# Altium schematic sheet 原理图Ver03_2023-04-25.schdoc
size 627 x 312 mm
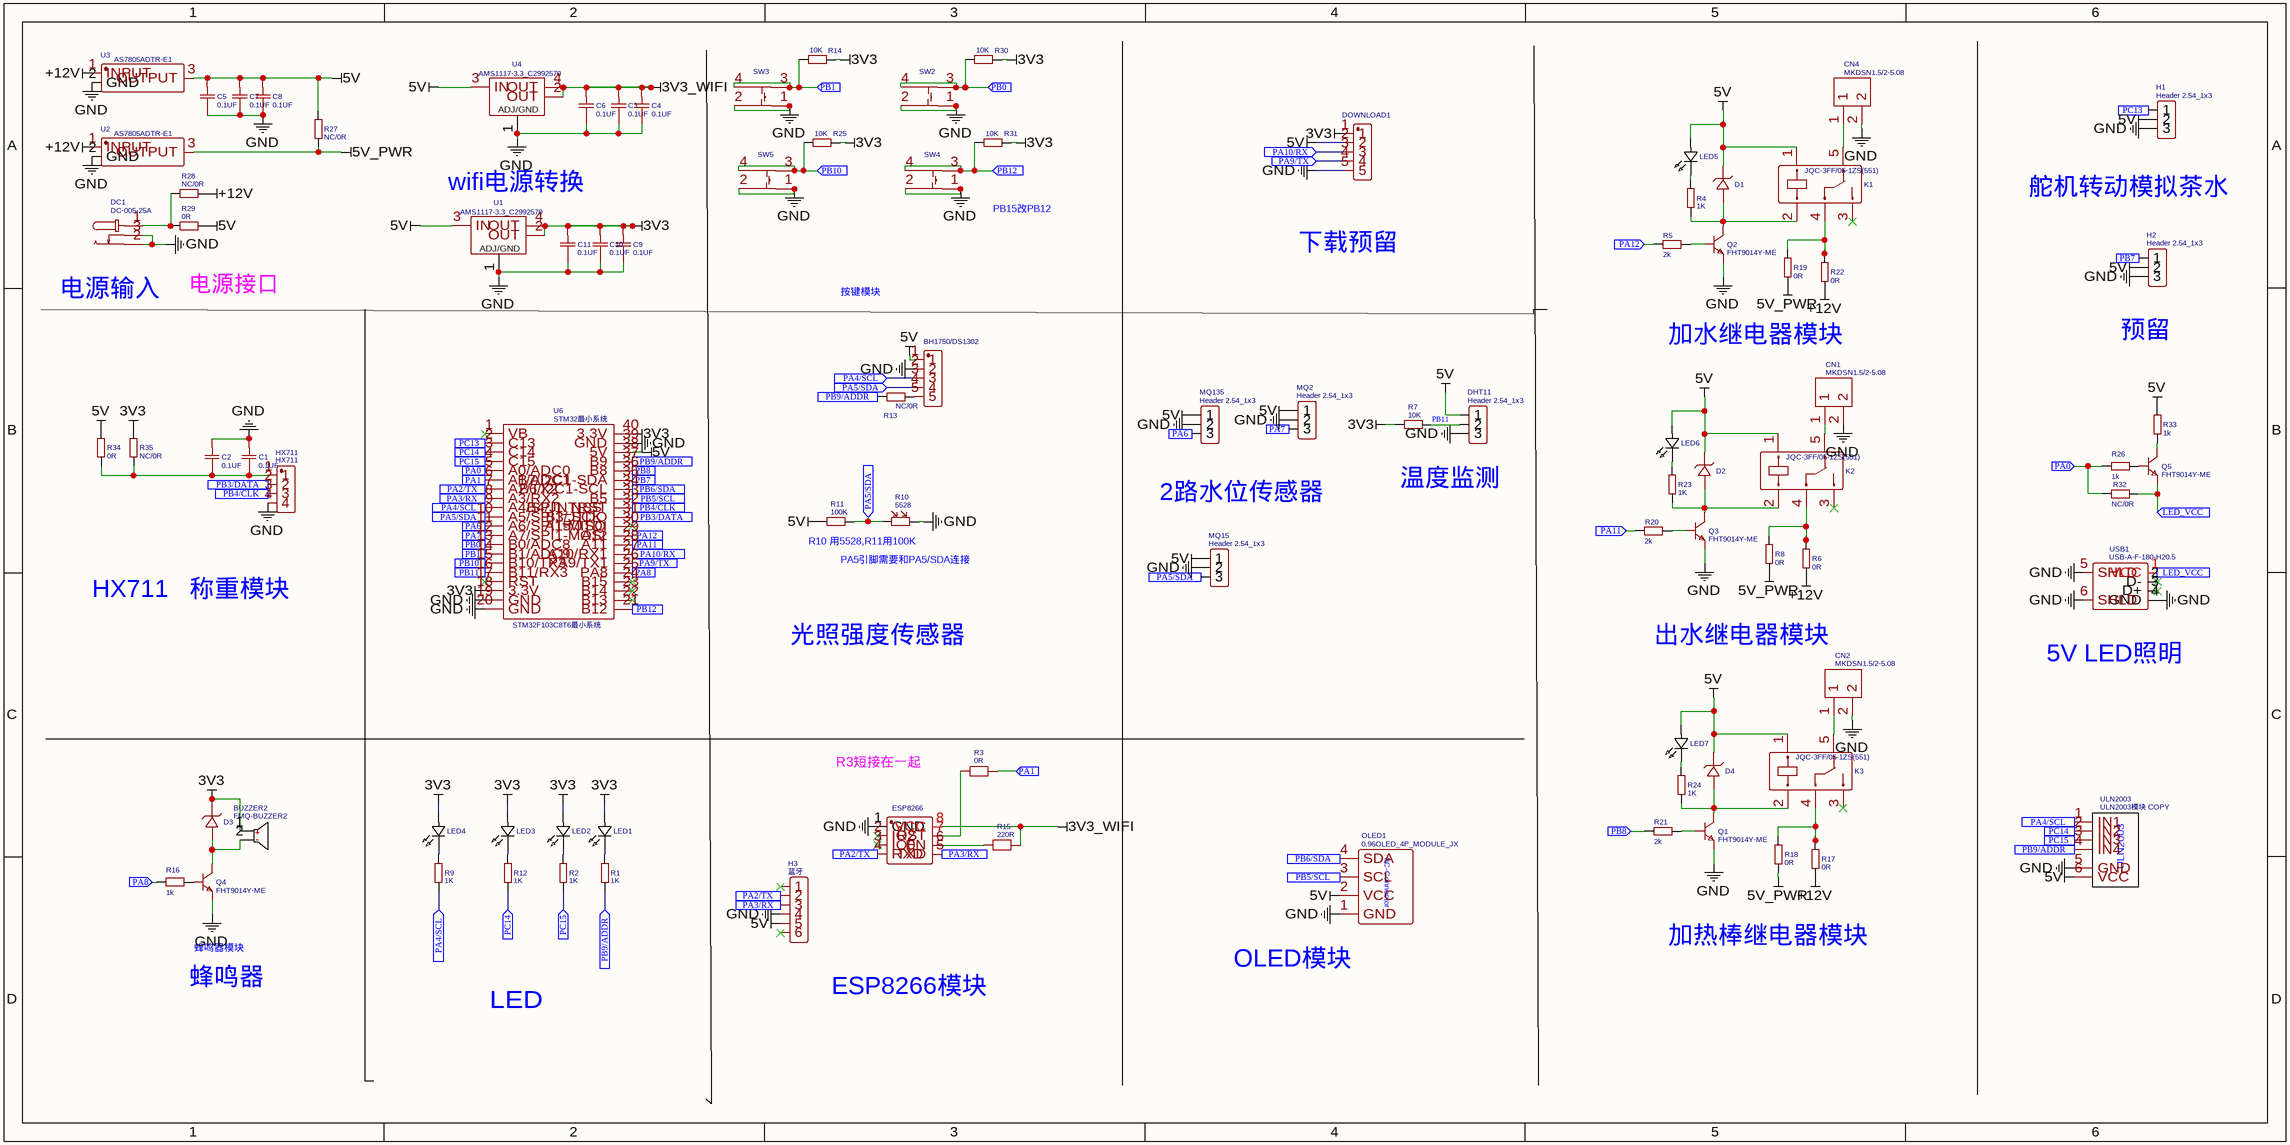
[diagram p0: 原理图Ver03_2023-04-25.schdoc]

## Parts
BH1750/DS1302  Female header　2.54 1*5Ｐ  [HDR-TH_5P-P2.54-V-F]  (value not drawn)
BUZZER2  FMQ-BUZZER2  [BUZ-TH_BD12.0-P7.60-D0.6-FD]
C1  0.1UF  [C0603]
C2  0.1UF  [C0603]
C3  0.1UF  [C0603]
C4  0.1UF  [C0603]
C5  0.1UF  [C0603]
C6  0.1UF  [C0603]
C7  0.1UF  [C0603]
C8  0.1UF  [C0603]
C9  0.1UF  [C0603]
C10  0.1UF  [C0603]
C11  0.1UF  [C0603]
CN1  MKDSN1.5/2-5.08  [CONN-TH_2P-P5.08_1714984]
CN2  MKDSN1.5/2-5.08  [CONN-TH_2P-P5.08_1714984]
CN4  MKDSN1.5/2-5.08  [CONN-TH_2P-P5.08_1714984]
D1  1N4734A_C238924  [LL-41_L5.0-W2.5-RD]  (value not drawn)
D2  1N4734A_C238924  [LL-41_L5.0-W2.5-RD]  (value not drawn)
D3  1N4734A_C238924  [LL-41_L5.0-W2.5-RD]  (value not drawn)
D4  1N4734A_C238924  [LL-41_L5.0-W2.5-RD]  (value not drawn)
DC1  DC-005-25A  [DC-IN-TH_DC005]
DHT11  Header 2.54_1x3  [HDR-TH_3P-P2.54-V-M-1]
DOWNLOAD1  Female header　2.54 1*5Ｐ  [HDR-TH_5P-P2.54-V-F]  (value not drawn)
ESP8266  ESP-01S_C503582  [WIFIM-TH_8P-L24.7-W14.4-P2.54]  (value not drawn)
H1  Header 2.54_1x3  [HDR-TH_3P-P2.54-V-M-1]
H2  Header 2.54_1x3  [HDR-TH_3P-P2.54-V-M-1]
H3  蓝牙  [HDR-TH_6P-P2.54-V-M-1]
HX711  HX711  [HDR-TH_4P-P2.54-V-F]
K1  JQC-3FF/05-1ZS(551)  [RELAY-TH_HF3FF-XX-1ZXX-XXX]
K2  JQC-3FF/05-1ZS(551)  [RELAY-TH_HF3FF-XX-1ZXX-XXX]
K3  JQC-3FF/05-1ZS(551)  [RELAY-TH_HF3FF-XX-1ZXX-XXX]
LED1  264-7SURT/S530-A3  [LED-TH_BD3.2-P2.54-RD]  (value not drawn)
LED2  264-7SURT/S530-A3  [LED-TH_BD3.2-P2.54-RD]  (value not drawn)
LED3  264-7SURT/S530-A3  [LED-TH_BD3.2-P2.54-RD]  (value not drawn)
LED4  264-7SURT/S530-A3  [LED-TH_BD3.2-P2.54-RD]  (value not drawn)
LED5  264-7SURT/S530-A3  [LED-TH_BD3.2-P2.54-RD]  (value not drawn)
LED6  264-7SURT/S530-A3  [LED-TH_BD3.2-P2.54-RD]  (value not drawn)
LED7  264-7SURT/S530-A3  [LED-TH_BD3.2-P2.54-RD]  (value not drawn)
MQ2  Header 2.54_1x3  [HDR-TH_3P-P2.54-V-M-1]
MQ15  Header 2.54_1x3  [HDR-TH_3P-P2.54-V-M-1]
MQ135  Header 2.54_1x3  [HDR-TH_3P-P2.54-V-M-1]
OLED1  0.96OLED_4P_MODULE_JX  [0.96OLED_4P]
Q1  FHT9014Y-ME  [SOT-23-3_L2.9-W1.3-P1.90-LS2.4-BR]
Q2  FHT9014Y-ME  [SOT-23-3_L2.9-W1.3-P1.90-LS2.4-BR]
Q3  FHT9014Y-ME  [SOT-23-3_L2.9-W1.3-P1.90-LS2.4-BR]
Q4  FHT9014Y-ME  [SOT-23-3_L2.9-W1.3-P1.90-LS2.4-BR]
Q5  FHT9014Y-ME  [SOT-23-3_L2.9-W1.3-P1.90-LS2.4-BR]
R1  1K  [0805]
R2  1K  [0805]
R3  0R  [R0603]
R4  1K  [0805]
R5  2k  [0805]
R6  0R  [0805]
R7  10K  [0805]
R8  0R  [0805]
R9  1K  [0805]
R10  5528  [RES-TH_L5.1-W4.3-P3.40-D0.5]
R11  100K  [0805]
R12  1K  [0805]
R13  NC/0R  [0805]
R14  10K  [0805]
R15  220R  [R0603]
R16  1k  [0805]
R17  0R  [0805]
R18  0R  [0805]
R19  0R  [0805]
R20  2k  [0805]
R21  2k  [0805]
R22  0R  [0805]
R23  1K  [0805]
R24  1K  [0805]
R25  10K  [0805]
R26  1k  [0805]
R27  NC/0R  [0805]
R28  NC/0R  [0805]
R29  0R  [0805]
R30  10K  [0805]
R31  10K  [0805]
R32  NC/0R  [0805]
R33  1k  [0805]
R34  0R  [0805]
R35  NC/0R  [0805]
SW2  K2-1102DP-A4SW-04  [SW-SMD_4P-L6.0-W6.0-P4.50-LS10.0-BL-SOKA]  (value not drawn)
SW3  K2-1102DP-A4SW-04  [SW-SMD_4P-L6.0-W6.0-P4.50-LS10.0-BL-SOKA]  (value not drawn)
SW4  K2-1102DP-A4SW-04  [SW-SMD_4P-L6.0-W6.0-P4.50-LS10.0-BL-SOKA]  (value not drawn)
SW5  K2-1102DP-A4SW-04  [SW-SMD_4P-L6.0-W6.0-P4.50-LS10.0-BL-SOKA]  (value not drawn)
U1  AMS1117-3.3_C2992570  [SOT-223-3_L6.4-W3.5-P2.30-LS7.0-BR]
U2  AS7805ADTR-E1  [TO-252-2_L6.6-W6.1-P4.57-LS9.9-BR-CW]
U3  AS7805ADTR-E1  [TO-252-2_L6.6-W6.1-P4.57-LS9.9-BR-CW]
U4  AMS1117-3.3_C2992570  [SOT-223-3_L6.4-W3.5-P2.30-LS7.0-BR]
U6  STM32最小系统  [STM32最小系统板C8T6]
ULN2003  ULN2003模块 COPY  [ULN2003-SOKA]
USB1  USB-A-F-180-H20.5  [USB-A-TH_C168710]

## Ports
LED_VCC (in), PA0 (in), PA1 (in), PA2/TX (in), PA3/RX (in), PA4/SCL (in), PA5/SDA (in), PA6 (in), PA7 (in), PA8 (in), PA9/TX (in), PA10/RX (in), PA11 (in), PA12 (in), PB0 (in), PB1 (in), PB3/DATA (in), PB4/CLK (in), PB5/SCL (in), PB6/SDA (in), PB7 (in), PB8 (in), PB9/ADDR (in), PB10 (in), PB11 (in), PB12 (in), PC13 (in), PC14 (in), PC15 (in)

## Nets
3V3: BUZZER2.1 C9.2 C10.2 C11.2 D3.1(K) DOWNLOAD1.1 LED1.2(+) LED2.2(+) LED3.2(+) LED4.2(+) R7.2 R14.1 R25.1 R30.1 R31.1 R35.2 U1.2(OUT) U1.4(OUT) U6.18(3.3V) U6.40(3.3V)
3V3_WIFI: C3.2 C4.2 C6.2 ESP8266.8(VCC) R15.1 U4.2(OUT) U4.4(OUT)
5V: BH1750/DS1302.1 C5.2 C7.2 C8.2 D1.1(K) D2.1(K) D4.1(K) DHT11.1 DOWNLOAD1.2 H1.2 H2.2 H3.5 K1.1 K2.1 K3.1 LED5.2(+) LED6.2(+) LED7.2(+) MQ2.1 MQ15.1 MQ135.1 OLED1.2(VCC) R11.2 R27.2 R29.2 R33.2 R34.2 U1.3(IN) U3.3(OUTPUT) U4.3(IN) U6.38(5V) ULN2003.6(VCC)
5V_PWR: R8.1 R18.1 R19.1 R27.1 U2.3(OUTPUT)
+12V: R6.1 R17.1 R22.1 R28.2 U2.1(INPUT) U3.1(INPUT)
GND: BH1750/DS1302.2 C1.2 C2.2 C3.1 C4.1 C5.1 C6.1 C7.1 C8.1 C9.1 C10.1 C11.1 CN1.2 CN2.2 CN4.2 DC1.2 DC1.3 DHT11.3 DOWNLOAD1.5 ESP8266.1(GND) H1.3 H2.3 H3.4 HX711.4 MQ2.2 MQ15.2 MQ135.2 OLED1.1(GND) Q1.2(E) Q2.2(E) Q3.2(E) Q4.2(E) R10.2 SW2.1 SW2.2 SW3.1 SW3.2 SW4.1 SW4.2 SW5.1 SW5.2 U1.1(ADJ/GND) U2.2(GND) U3.2(GND) U4.1(ADJ/GND) U6.19(GND) U6.20(GND) U6.39(GND) ULN2003.5(GND) USB1.4(GND) USB1.5(SHLD) USB1.6(SHLD)
LED_VCC: Q5.2(E) R32.2 USB1.1(VCC) ; port LED_VCC
PA0: R26.1 R32.1 U6.5(A0/ADC0) ; port PA0
PA1: R3.1 U6.6(A1/ADC1) ; port PA1
PA2/TX: ESP8266.4(RXD) H3.2 U6.7(A2/TX2) ; port PA2/TX
PA3/RX: ESP8266.5(TXD) H3.3 U6.8(A3/RX2) ; port PA3/RX
PA4/SCL: BH1750/DS1302.3 R9.1 U6.9(A4/SPI1_NSS) ULN2003.1(IN1) ; port PA4/SCL
PA5/SDA: BH1750/DS1302.4 MQ15.3 R10.1 R11.1 U6.10(A5/SPI1_SCK) ; port PA5/SDA
PA6: MQ135.3 U6.11(A6/SPI1-MISO) ; port PA6
PA7: MQ2.3 U6.12(A7/SPI1-MOSI) ; port PA7
PA8: R16.1 U6.25(PA8) ; port PA8
PA9/TX: DOWNLOAD1.4 U6.26(PA9/TX1) ; port PA9/TX
PA10/RX: DOWNLOAD1.3 U6.27(A10/RX1) ; port PA10/RX
PA11: R20.1 U6.28(A11) ; port PA11
PA12: R5.1 U6.29(A12) ; port PA12
PB0: R30.2 SW2.3 SW2.4 U6.13(B0/ADC8) ; port PB0
PB1: R14.2 SW3.3 SW3.4 U6.14(B1/ADC9) ; port PB1
PB3/DATA: HX711.2 U6.31(B3/JTDO) ; port PB3/DATA
PB4/CLK: HX711.3 U6.32(B4/JNTRST) ; port PB4/CLK
PB5/SCL: OLED1.3(SCL) U6.33(B5) ; port PB5/SCL
PB6/SDA: OLED1.4(SDA) U6.34(B6/I2C1-SCL) ; port PB6/SDA
PB7: H2.1 U6.35(B7/I2C1-SDA) ; port PB7
PB8: R21.1 U6.36(B8) ; port PB8
PB9/ADDR: R1.1 R13.2 U6.37(B9) ULN2003.4(IN4) ; port PB9/ADDR
PB10: R25.2 SW5.3 SW5.4 U6.15(B10/TX3) ; port PB10
PB11: U6.16(B11/RX3) ; port PB11
PB11: DHT11.2 R7.1  [a separate net that carries the same name]
PB12: R31.2 SW4.3 SW4.4 U6.21(B12) ; port PB12
PC13: H1.1 U6.2(C13) ; port PC13
PC14: R12.1 U6.3(C14) ULN2003.2(IN2) ; port PC14
PC15: R2.1 U6.4(C15) ULN2003.3(IN3) ; port PC15
NetBH1750/DS1302_5: BH1750/DS1302.5 R13.1
NetBUZZER2_2: BUZZER2.2 D3.2(A) Q4.3(C)
NetC1_1: C1.1 C2.1 HX711.1 R34.1 R35.1
NetCN1_1: CN1.1 K2.5
NetCN2_1: CN2.1 K3.5
NetCN4_1: CN4.1 K1.5
NetD1_2: D1.2(A) K1.2 Q2.3(C) R4.1
NetD2_2: D2.2(A) K2.2 Q3.3(C) R23.1
NetD4_2: D4.2(A) K3.2 Q1.3(C) R24.1
NetDC1_1: DC1.1 R28.1 R29.1
NetESP8266_6: ESP8266.6(EN) R15.2
NetESP8266_7: ESP8266.7(RST) R3.2
NetK1_4: K1.4 R19.2 R22.2
NetK2_4: K2.4 R6.2 R8.2
NetK3_4: K3.4 R17.2 R18.2
NetLED1_1: LED1.1(-) R1.2
NetLED2_1: LED2.1(-) R2.2
NetLED3_1: LED3.1(-) R12.2
NetLED4_1: LED4.1(-) R9.2
NetLED5_1: LED5.1(-) R4.2
NetLED6_1: LED6.1(-) R23.2
NetLED7_1: LED7.1(-) R24.2
NetQ1_1: Q1.1(B) R21.2
NetQ2_1: Q2.1(B) R5.2
NetQ3_1: Q3.1(B) R20.2
NetQ4_1: Q4.1(B) R16.2
NetQ5_1: Q5.1(B) R26.2
NetQ5_3: Q5.3(C) R33.1

Not connected (* = marked no-connect by the designer): ESP8266 2(IO2)* 3(IO0)*; H3 1* 6*; K1 3*; K2 3*; K3 3*; U6 1(VB)* 17(RST)* 22(B13)* 23(B14)* 24(B15)* 30(A15/JTDI)*; USB1 2(D-)* 3(D+)*

## Notes on the sheet
- wifi电源转换
- PB15改PB12
- 舵机转动模拟茶水
- 下载预留
- (near DC1) 电源输入
- 电源接口
- 按键模块
- 加水继电器模块
- 预留
- 2路水位传感器
- 温度监测
- R10 用5528,R11用100K
- HX711   称重模块
- PA5引脚需要和PA5/SDA连接
- 光照强度传感器
- 出水继电器模块
- 5V LED照明
- R3短接在一起
- 蜂鸣器模块
- OLED模块
- 加热棒继电器模块
- 蜂鸣器
- LED
- ESP8266模块
- (in symbol 0.96OLED_4P_MODULE_JX) IIC-Connector
- (in symbol STM32最小系统) STM32F103C8T6最小系统

## Library data of the parts
BH1750/DS1302 DOWNLOAD1 = Female header　2.54 1*5Ｐ: BOM_Manufacturer: ReliaPro; BOM_Supplier Part: C46341; BOM_Supplier: LCSC; BOM_Manufacturer Part: Female header　2.54 1*5Ｐ; spicePre: H; spiceSymbolName: Female header　2.54 1*5Ｐ
BUZZER2 = FMQ-BUZZER2: Contributor: LCSC; BOM_Supplier: LCSC; BOM_Supplier Part: C9900006103; BOM_Manufacturer Part: FMQ-BUZZER2; BOM_JLCPCB Part Class: Extended Part; spicePre: B; spiceSymbolName: FMQ-BUZZER2
C1-C11 = 0.1UF: nameAlias: Value(F); Contributor: LCEDA_Lib; spicePre: C; spiceSymbolName: C_0603_US
CN1 CN2 CN4 = MKDSN1.5/2-5.08: BOM_Manufacturer: Phoenix Contact; BOM_Supplier: LCSC; BOM_Manufacturer Part: MKDSN1.5/2-5.08; BOM_Supplier Part: C91153; BOM_JLCPCB Part Class: Extended Part; spicePre: C; spiceSymbolName: MKDSN1.5/2-5.08
D1-D4 = 1N4734A_C238924: BOM_Manufacturer: ON Semicon; Contributor: LCSC; BOM_Supplier: LCSC; BOM_Supplier Part: C238924; BOM_Manufacturer Part: 1N4734A; BOM_JLCPCB Part Class: Extended Part; spicePre: D; spiceSymbolName: 1N4734A_C238924
DC1 = DC-005-25A: BOM_Manufacturer: HRO; Contributor: LCSC; BOM_Supplier: LCSC; BOM_Manufacturer Part: DC-005-25A; BOM_Supplier Part: C136715; spicePre: D; spiceSymbolName: DC-005-25A
DHT11 H1 H2 MQ2 MQ15 MQ135 = Header 2.54_1x3: BOM_Manufacturer: BOOMELE; BOM_Manufacturer Part: Header2.54mm 1*3P; BOM_Supplier: LCSC; BOM_Supplier Part: C49257; BOM_JLCPCB Part Class: Extended Part; spicePre: H; spiceSymbolName: Header-Male-2.54_1x3
ESP8266 = ESP-01S_C503582: BOM_Manufacturer: Ai-Thinker; Contributor: LCSC; BOM_Supplier: LCSC; BOM_Supplier Part: C503582; BOM_Manufacturer Part: ESP-01S; spicePre: U; spiceSymbolName: ESP-01S_C503582
H3 = 蓝牙: BOM_Manufacturer: BOOMELE; BOM_Manufacturer Part: Header-Male-2.54_1x6; BOM_Supplier: LCSC; BOM_Supplier Part: C37208; BOM_JLCPCB Part Class: Extended Part; spicePre: H; spiceSymbolName: Header-Male-2.54_1x6
HX711 = HX711: BOM_Manufacturer: BOOMELE; BOM_Manufacturer Part: Female header1*4P; Contributor: Sally; BOM_Supplier: LCSC; BOM_Supplier Part: C66508; spicePre: P; spiceSymbolName: Female header1*4P
K1-K3 = JQC-3FF/05-1ZS(551): BOM_Manufacturer: HF; BOM_Supplier: LCSC; BOM_Manufacturer Part: JQC-3FF/05-1ZS(551); BOM_Supplier Part: C9221; BOM_JLCPCB Part Class: Extended Part; spicePre: K; spiceSymbolName: JQC-3FF/05-1ZS(551)
LED1-LED7 = 264-7SURT/S530-A3: BOM_Manufacturer: Everlight Elec; Contributor: LCSC; Package Display: No; BOM_Supplier: LCSC; BOM_Supplier Part: C710207; BOM_Manufacturer Part: 264-7SURT/S530-A3; spicePre: L; spiceSymbolName: 264-7SURT/S530-A3
OLED1 = 0.96OLED_4P_MODULE_JX: BOM_Manufacturer: null; Contributor: LCSC; BOM_Supplier: LCSC; BOM_Supplier Part: C9900004566; BOM_Manufacturer Part: 0.96OLED_4P_MODULE_JX; BOM_JLCPCB Part Class: Extended Part; spicePre: O; spiceSymbolName: 0.96OLED_4P_MODULE_JX
Q1-Q5 = FHT9014Y-ME: BOM_Manufacturer: FH; BOM_Supplier: LCSC; BOM_Manufacturer Part: FHT9014Y-ME; BOM_Supplier Part: C88861; BOM_JLCPCB Part Class: Extended Part; spicePre: Q; spiceSymbolName: FHT9014Y-ME
R1 R2 R4 R9 R12 R23 R24 = 1K: BOM_Manufacturer: Tyohm; BOM_Manufacturer Part: RMC08051K5%N; nameAlias: Resistance (Ohms); Contributor: LCSC; BOM_Supplier: LCSC; BOM_Supplier Part: C269727; spicePre: R; spiceSymbolName: RMC08051K5%N
R3 = 0R: nameAlias: Value(Ω); Contributor: LCEDA_Lib; spicePre: R; spiceSymbolName: R_0603_EU
R5 R20 R21 = 2k: BOM_Manufacturer: Tyohm; BOM_Manufacturer Part: RMC08051K5%N; nameAlias: Resistance (Ohms); Contributor: LCSC; BOM_Supplier: LCSC; BOM_Supplier Part: C269727; spicePre: R; spiceSymbolName: RMC08051K5%N
R6 R8 R17-R19 R22 R29 R34 = 0R: BOM_Manufacturer: Tyohm; BOM_Manufacturer Part: RMC08051K5%N; nameAlias: Resistance (Ohms); Contributor: LCSC; BOM_Supplier: LCSC; BOM_Supplier Part: C269727; spicePre: R; spiceSymbolName: RMC08051K5%N
R7 R14 R25 R30 R31 = 10K: BOM_Manufacturer: Tyohm; BOM_Manufacturer Part: RMC08051K5%N; nameAlias: Resistance (Ohms); Contributor: LCSC; BOM_Supplier: LCSC; BOM_Supplier Part: C269727; spicePre: R; spiceSymbolName: RMC08051K5%N
R10 = 5528: BOM_Manufacturer: Senba; BOM_Manufacturer Part: GL5539; BOM_Supplier: LCSC; BOM_Supplier Part: C125630; BOM_JLCPCB Part Class: Extended Part; spicePre: R; spiceSymbolName: GL5539
R11 = 100K: BOM_Manufacturer: Tyohm; BOM_Manufacturer Part: RMC08051K5%N; nameAlias: Resistance (Ohms); Contributor: LCSC; BOM_Supplier: LCSC; BOM_Supplier Part: C269727; spicePre: R; spiceSymbolName: RMC08051K5%N
R13 R27 R28 R32 R35 = NC/0R: BOM_Manufacturer: Tyohm; BOM_Manufacturer Part: RMC08051K5%N; nameAlias: Resistance (Ohms); Contributor: LCSC; BOM_Supplier: LCSC; BOM_Supplier Part: C269727; spicePre: R; spiceSymbolName: RMC08051K5%N
R15 = 220R: nameAlias: Value(Ω); Contributor: LCEDA_Lib; spicePre: R; spiceSymbolName: R_0603_EU
R16 R26 R33 = 1k: BOM_Manufacturer: Tyohm; BOM_Manufacturer Part: RMC08051K5%N; nameAlias: Resistance (Ohms); Contributor: LCSC; BOM_Supplier: LCSC; BOM_Supplier Part: C269727; spicePre: R; spiceSymbolName: RMC08051K5%N
SW2-SW5 = K2-1102DP-A4SW-04: BOM_Manufacturer: Korean Hroparts Elec; Contributor: LCSC; BOM_Supplier: LCSC; BOM_Supplier Part: C223769; BOM_Manufacturer Part: K2-1102DP-A4SW-04; BOM_JLCPCB Part Class: Extended Part; spicePre: S; spiceSymbolName: K2-1102DP-A4SW-04
U1 U4 = AMS1117-3.3_C2992570: BOM_Manufacturer: 国芯佳品; Contributor: lcsc; BOM_Supplier: LCSC; BOM_Supplier Part: C2992570; BOM_Manufacturer Part: AMS1117-3.3; link: https://atta.szlcsc.comnull; BOM_JLCPCB Part Class: Extended Part; spicePre: U; spiceSymbolName: AMS1117-3.3_C2992570
U2 U3 = AS7805ADTR-E1: BOM_Manufacturer: Diodes Incorporated; Contributor: LCSC; BOM_Supplier: LCSC; BOM_Supplier Part: C127926; BOM_Manufacturer Part: AS7805ADTR-E1; BOM_JLCPCB Part Class: Extended Part; spicePre: U; spiceSymbolName: AS7805ADTR-E1
U6 = STM32最小系统: Contributor: huang12; spicePre: U; spiceSymbolName: STM32最小系统
ULN2003 = ULN2003模块 COPY: Contributor: xxtfi; spicePre: U; spiceSymbolName: ULN2003模块
USB1 = USB-A-F-180-H20.5: BOM_Manufacturer: 精拓金; BOM_Manufacturer Part: 916-151A101DY10200; Contributor: LCSC; BOM_Supplier: LCSC; BOM_Supplier Part: C168710; BOM_JLCPCB Part Class: Extended Part; spicePre: U; spiceSymbolName: USB-A-F-180-H20.5